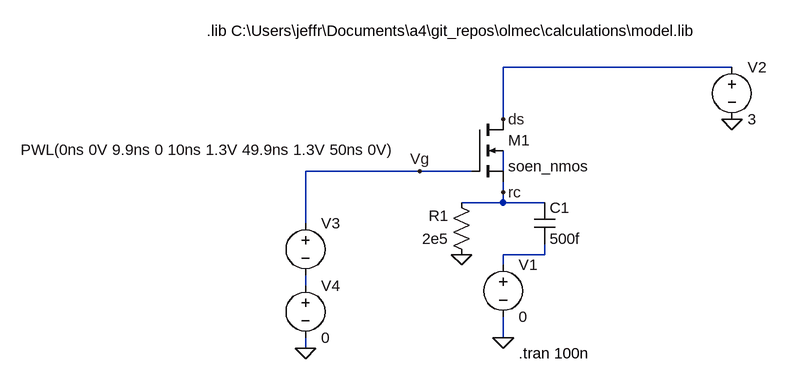
[diagram p0: schematic mosfet_rc.asc]
mosfet_rc.asc, the LTspice schematic file:
Version 4
SHEET 1 880 680
WIRE 80 144 -272 144
WIRE -272 224 -272 144
WIRE -400 304 -576 304
WIRE -320 304 -400 304
WIRE -272 304 -272 272
WIRE -272 336 -272 320
WIRE -272 352 -272 336
WIRE -272 352 -336 352
WIRE -208 352 -272 352
WIRE -576 384 -576 304
WIRE -208 432 -208 416
WIRE -208 432 -272 432
WIRE -272 448 -272 432
WIRE -576 480 -576 464
WIRE -272 560 -272 528
WIRE -576 576 -576 560
FLAG 80 224 0
FLAG -576 576 0
FLAG -272 224 ds
FLAG -400 304 Vg
FLAG -272 560 0
FLAG -272 336 rc
FLAG -336 432 0
SYMBOL voltage 80 128 R0
WINDOW 123 0 0 Left 0
WINDOW 39 0 0 Left 0
SYMATTR InstName V2
SYMATTR Value 3
SYMBOL voltage -576 368 R0
WINDOW 123 0 0 Left 0
WINDOW 39 0 0 Left 0
WINDOW 3 -438 -97 Left 2
SYMATTR Value PWL(0ns 0V 9.9ns 0 10ns 1.3V 49.9ns 1.3V 50ns 0V)
SYMATTR InstName V3
SYMBOL nmos4 -320 224 R0
SYMATTR InstName M1
SYMATTR Value soen_nmos
SYMATTR Value2 l=1u w=10u
SYMBOL cap -224 352 R0
SYMATTR InstName C1
SYMATTR Value 500f
SYMBOL res -320 448 R180
WINDOW 0 36 76 Left 2
WINDOW 3 36 40 Left 2
SYMATTR InstName R1
SYMATTR Value 2e5
SYMBOL voltage -272 432 R0
WINDOW 123 0 0 Left 0
WINDOW 39 0 0 Left 0
SYMATTR InstName V1
SYMATTR Value 0
SYMBOL voltage -576 464 R0
WINDOW 123 0 0 Left 0
WINDOW 39 0 0 Left 0
SYMATTR InstName V4
SYMATTR Value 0
TEXT -248 584 Left 2 !.tran 100n
TEXT -728 88 Left 2 !.lib C:\\Users\\jeffr\\Documents\\a4\\git_repos\\olmec\\calculations\\model.lib

The netlist it stands for:
* mosfet_rc.asc
V2 ds 0 3
V3 Vg N003 PWL(0ns 0V 9.9ns 0 10ns 1.3V 49.9ns 1.3V 50ns 0V)
M1 ds Vg rc N001 soen_nmos l=1u w=10u
C1 rc N002 500f
R1 0 rc 2e5
V1 N002 0 0
V4 N003 0 0
.model NMOS NMOS
.model PMOS PMOS
.lib standard.mos
.tran 100n
.lib C:\Users\jeffr\Documents\a4\git_repos\olmec\calculations\model.lib
.backanno
.end